# EAGLE design dasblinkenhat-controller-mk-2.0 (EAGLE 7.5.0)
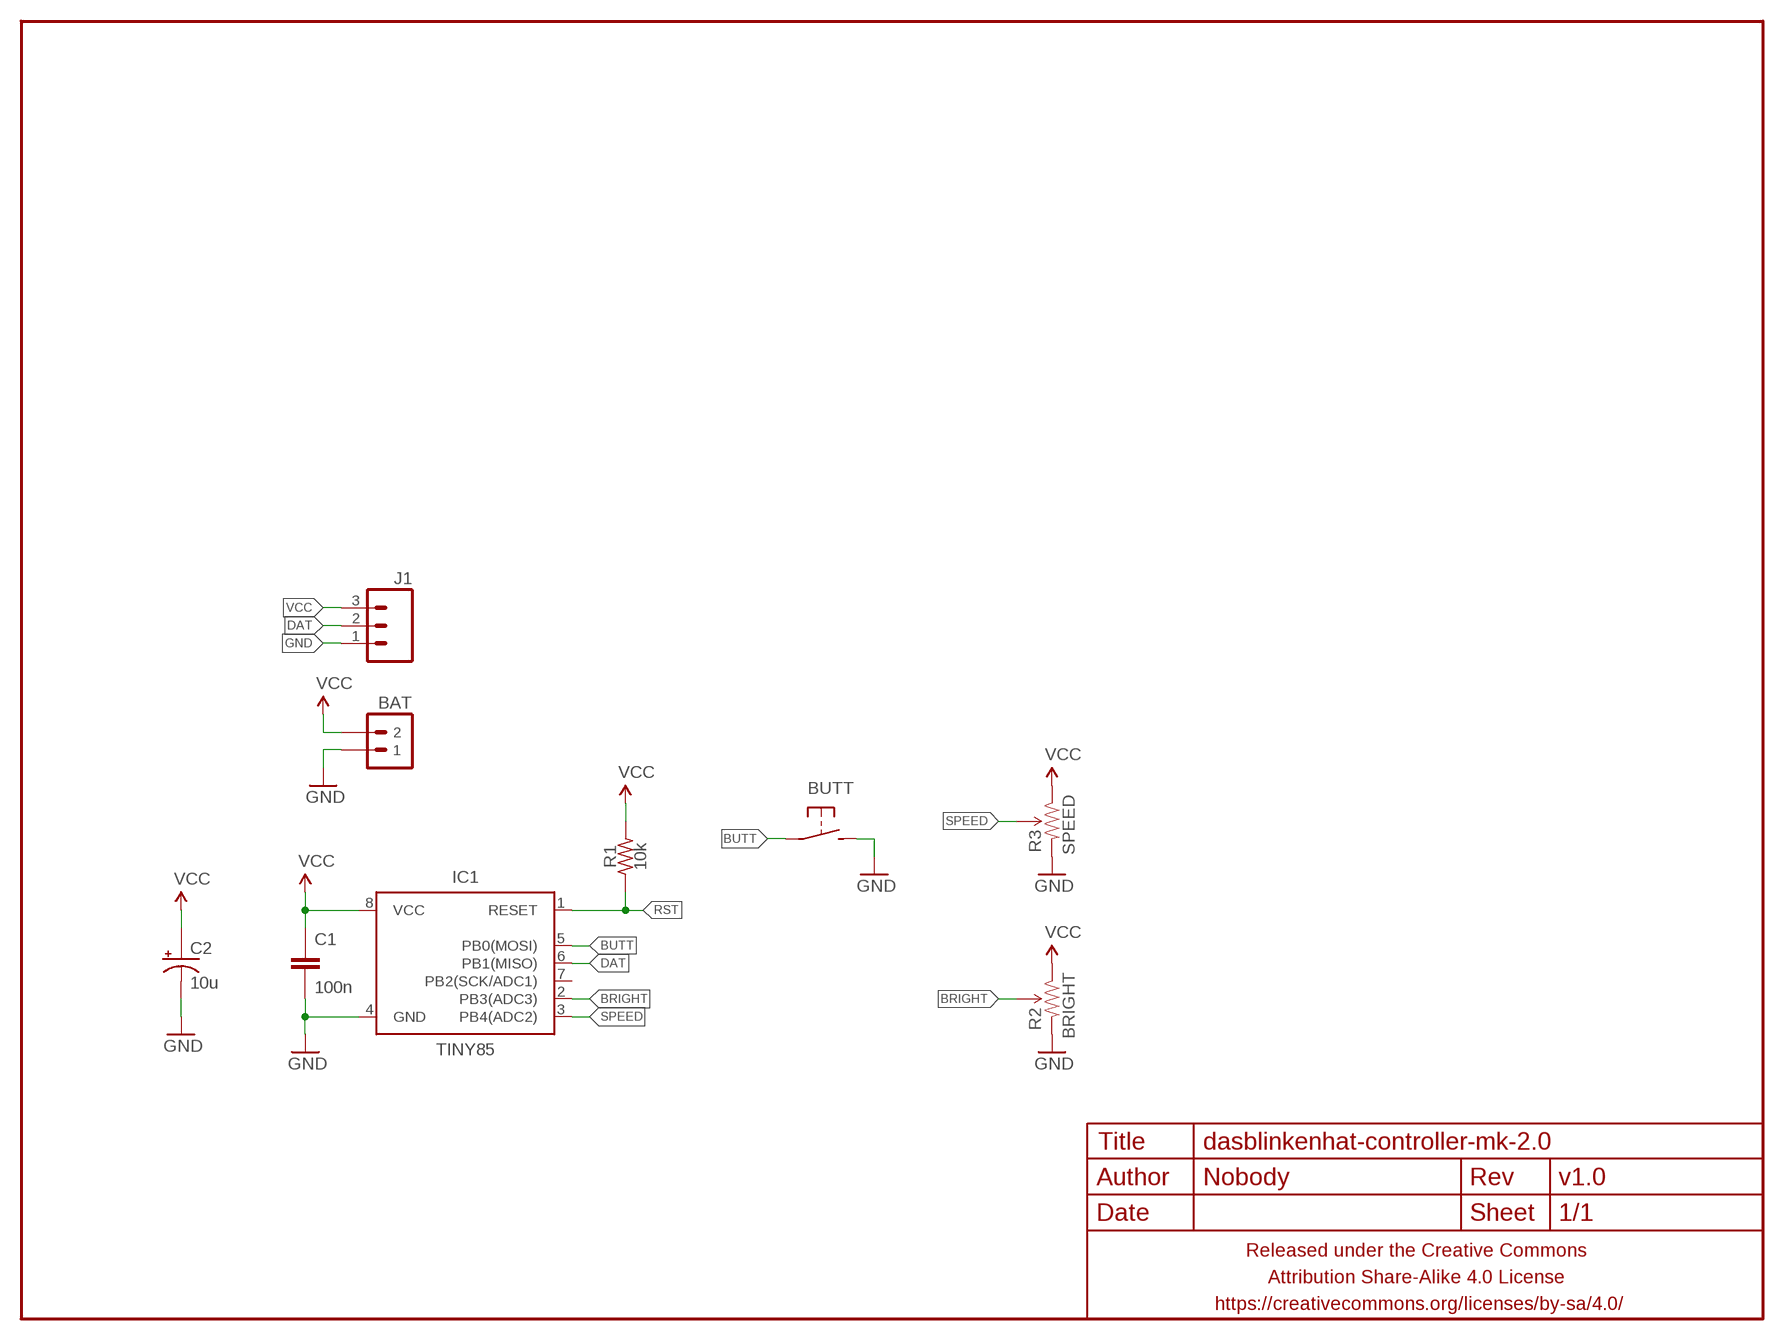
[diagram p0: schematic, sheet 1]

## Parts
BAT  M02JST-PTH-RA-R+  [JST-2-PH-RA-PTH-R+]
BUTT  DTS-6MM  SPST-NO-TACT6MM-PTH-SMALL-PADS  [DTS-6-SMALL-PADS]
C1  100n  CAPACITOR-CERAMIC025-024X044  [C025-024X044]
C2  10u  CAPACITOR-POLARIZEDE2-5  [E2-5]
FRAME1  FRAME-LETTERNO_PACKAGE  [DUMMY]
IC1  TINY85  ATTINY45TINY85-20-DIP  [DIP08]
J1  M03JST-XH-RA-PTH  [JST-3-XH-RA-PTH]
R1  10k  RESISTORPTH-AXIAL-5.08MM  [RESISTOR-AXIAL-PTH-5.08MM]
R2  BRIGHT  TRIMPOTPTH2  [TRIM_POT_PTH2]
R3  SPEED  TRIMPOTPTH2  [TRIM_POT_PTH2]

## Nets
BRIGHT: IC1.2(PB3(ADC3)) R2.2(WIPER)
BUTT: BUTT.1 BUTT.2 IC1.5(PB0(MOSI))
DAT: IC1.6(PB1(MISO)) J1.2
GND: BAT.1 BUTT.3 BUTT.4 C1.2 C2.- IC1.4(GND) J1.1 R2.3(CW) R3.3(CW)
RST: IC1.1(RESET) R1.P$1
SPEED: IC1.3(PB4(ADC2)) R3.2(WIPER)
VCC: BAT.2 C1.1 C2.+ IC1.8(VCC) J1.3 R1.P$2 R2.1(CCW) R3.1(CCW)
Unconnected: IC1.7(PB2(SCK/ADC1))

## Library data of the parts
BAT = a_parts:M02: Standard 2-pin 0.1" header. Use with - straight break away headers ( PRT-00116) - right angle break away headers (PRT-00553) - swiss pins (PRT-00743) - machine pins (PRT-00117) - female headers (PRT-00115) Molex polarized connector foot print use with: PRT-08233 with associated crimp pins and housings. 2.54_SCREWTERM for use with PRT-10571. 3.5mm Screw Terminal footprints for PRT-08084 5mm Screw Terminal footprints for use with PRT-08433
BUTT = A_butts:SPST-NO-TACT
C1 = A_butts:CAPACITOR-CERAMIC: CAPACITOR, European symbol
C2 = a_parts:CAPACITOR-POLARIZED: POLARIZED CAPACITOR, American symbol
FRAME1 = a_parts:FRAME-LETTER: Schematic Frame Standard 8.5x11 US Letter frame; DESIGNER: Nobody; VERSION: v1.0
IC1 = A_butts:ATTINY45: Atmel 8-pin 2/4/8kB flash uC; PROD_ID: IC-09445; VALUE: TINY85-20-DIP
J1 = a_parts:M03: Header 3 Standard 3-pin 0.1" header. Use with straight break away headers (SKU : PRT-00116), right angle break away headers (PRT-00553), swiss pins (PRT-00743), machine pins (PRT-00117), and female headers (PRT-00115). Molex polarized connector foot print use with SKU : PRT-08232 with associated crimp pins and housings.
R1 = A_butts:RESISTOR: RESISTOR, American symbol
R2 R3 = a_parts:TRIMPOT: Various small potentiometers for "set-and-forget" applications

## Board
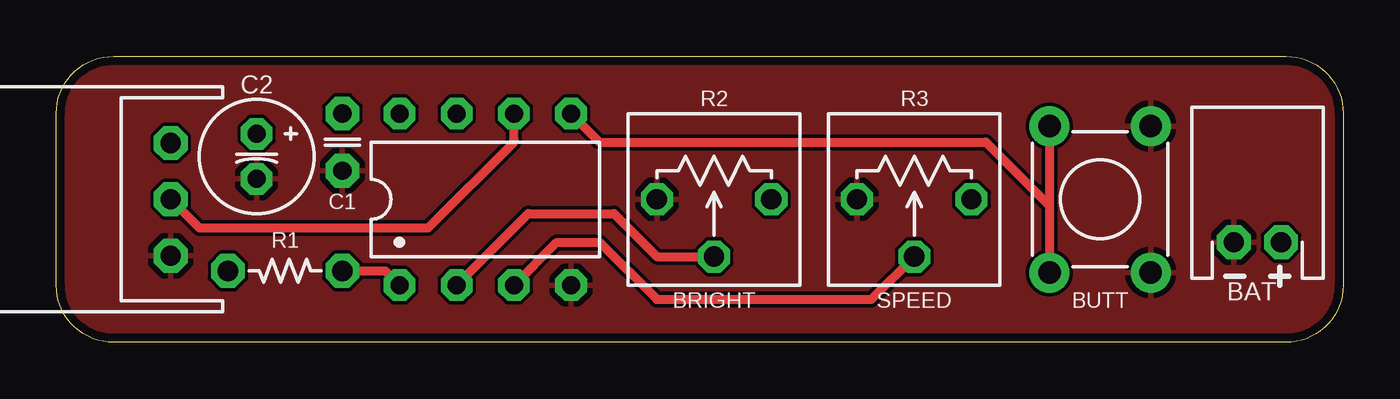
[diagram p1: board, top side]
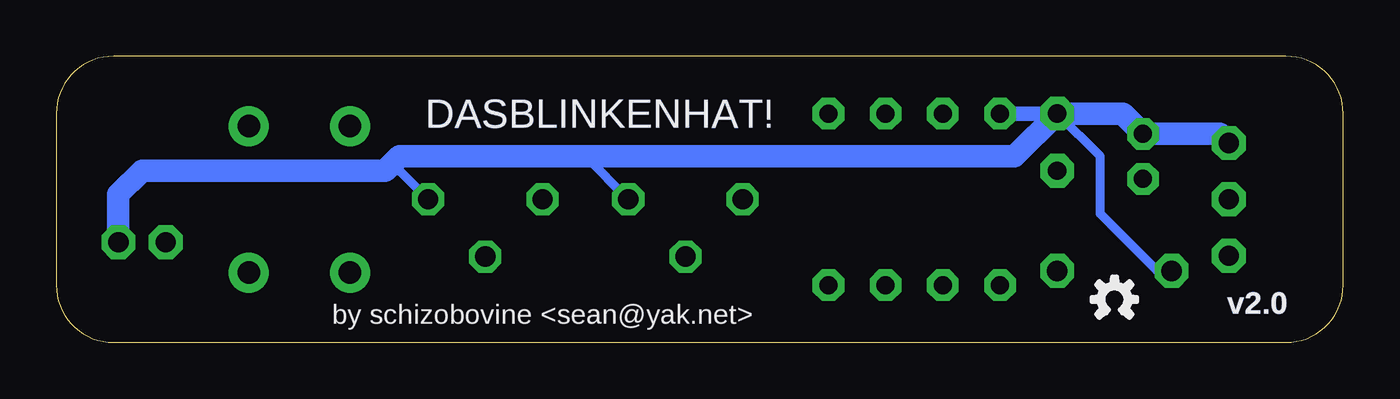
[diagram p2: board, bottom side, seen from below]

Size 57.15 x 12.7 mm. Coordinates in mm from the lower left corner, seen from the top.
Outline: 57.15,10.16 57.15,2.54 arc-90 54.61,0 2.54,0 arc-90 0,2.54 0,10.16 arc-90 2.54,12.7 54.61,12.7 arc-90 57.15,10.16
Copper layers (1*16): Top 0.0356mm / dielectric 1.5011mm / Bottom 0.0356mm
Design rules "LaenPCBOrder2": minimum track width 6mil, minimum drill 13mil, track to track 6mil, track to pad 6mil, pad to pad 6mil, via to via 6mil, smd to smd 6mil, copper to edge 15mil, drill to drill 6mil, minimum pad ring 7mil, minimum via ring 7mil, stop-mask expansion 3mil, vias tented up to drill 20mil, thermal gap 10mil

### Footprints (pad centres in the part's own frame; a part is rotated, then mirrored left to right if it is on the bottom)
JST-2-PH-RA-PTH-R+ = drill 0.9 pad 1.5 octagon: 1 -1.05,0; 2 1.05,0
DTS-6-SMALL-PADS = drill 1 pad 1.778: 1 -3.25,2.25; 2 3.25,2.25; 3 -3.25,-2.25; 4 3.25,-2.25
C025-024X044 = drill 0.813 pad 1.5 octagon: 1 -1.27,0; 2 1.27,0
E2-5 = drill 0.8 pad 1.4 octagon: + -1,0; - 1,0
DIP08 = drill 0.8 pad 1.4 octagon: 1 -3.81,-3.81; 2 -1.27,-3.81; 3 1.27,-3.81; 4 3.81,-3.81; 5 3.81,3.81; 6 1.27,3.81; 7 -1.27,3.81; 8 -3.81,3.81
JST-3-XH-RA-PTH = drill 0.9 pad 1.5 octagon: 1 -2.5,0; 2 0,0; 3 2.5,0
RESISTOR-AXIAL-PTH-5.08MM = drill 0.9 pad 1.5 octagon: P$1 -2.54,0; P$2 2.54,0
TRIM_POT_PTH2 = drill 0.9 pad 1.422 octagon: 1 -2.54,0; 2 0,2.54; 3 2.54,0

### Placement (x,y rotation side)
BAT  53.34,4.45 0 top
BUTT  46.35,6.35 90 top
C1  12.7,8.89 270 top
C2  8.89,8.26 270 top
FRAME1  0,0 0 top
IC1  19.05,6.35 0 top
J1  5.08,6.35 90 top
R1  10.16,3.17 180 top
R2  29.21,6.35 180 top
R3  38.1,6.35 180 top
U$2  [OSHWLOGO_TINY_SILKONLY]  10.16,1.91 0 bottom

### Tracks (layer width: path | path; a pad name or v marks a point on that pad's centre or on a via)
BRIGHT
  Top 0.406: IC1.2 20.95,5.71 24.77,5.71 26.67,3.81 R2.2
BUTT
  Top 0.406: IC1.5 24.13,8.89 41.27,8.89 44.1,6.06 | 44.1,6.06 BUTT.1 | BUTT.2 44.1,6.06
DAT
  Top 0.406: J1.2 6.35,5.08 16.51,5.08 20.32,8.89 IC1.6
GND
  pour Top: 57.15,10.16 57.15,2.54 arc-90 54.61,0 2.54,0 arc-90 0,2.54 0,10.16 arc-90 2.54,12.7 54.61,12.7 arc-90
RST
  Top 0.406: R1.P$1 14.61,3.17 IC1.1
SPEED
  Top 0.406: IC1.3 22.23,4.45 24.13,4.45 26.67,1.91 36.2,1.91 R3.2
VCC
  Bottom 0.406: R1.P$2 8.26,3.17 10.79,5.71 10.79,8.26 C1.1 | 42.55,7.62 41.91,7.62 R3.1 | R2.1 33.66,8.26
  Bottom 0.635: IC1.8 C1.1
  Bottom 1: BAT.2 54.39,6.57 53.34,7.62 42.55,7.62 41.91,8.26 33.66,8.26 14.61,8.26 C1.1 9.79,10.16 C2.+ 5.49,9.26 J1.3